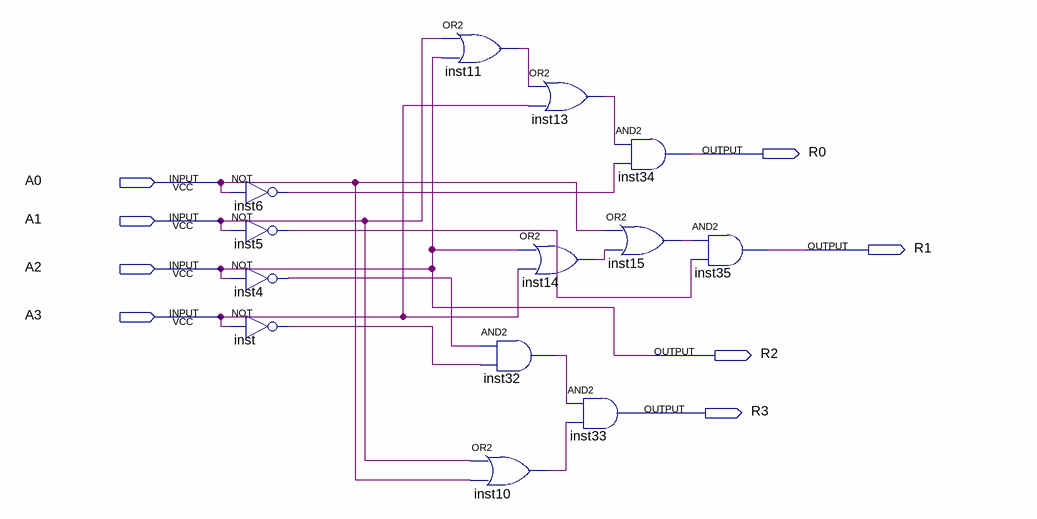
[diagram p0: schematic sheet]
// Quartus schematic MOD_11_NEG.bdf as structural Verilog: 13 symbols, 8 pins
module MOD_11_NEG (
  input  A0,
  input  A1,
  input  A2,
  input  A3,
  output R0,
  output R1,
  output R2,
  output R3
);

  wire inst4_out, inst5_out, inst6_out, inst10_out, inst11_out, inst13_out, inst14_out, inst15_out,
       inst32_out, inst_out;

  not inst6 (inst6_out, A0);
  not inst5 (inst5_out, A1);
  not inst4 (inst4_out, A2);
  not inst (inst_out, A3);
  or inst11 (inst11_out, A1, A2);
  and inst32 (inst32_out, inst4_out, inst_out);
  or inst10 (inst10_out, A1, A0);
  or inst13 (inst13_out, inst11_out, A3);
  or inst14 (inst14_out, A2, A3);
  and inst33 (R3, inst32_out, inst10_out);
  and inst34 (R0, inst13_out, inst6_out);
  or inst15 (inst15_out, A0, inst14_out);
  and inst35 (R1, inst15_out, inst5_out);

  assign R2 = A2;
endmodule
